# Altium schematic sheet ESPMODULE-E.B.EL-VENOM.SchDoc
size 381 x 241 mm
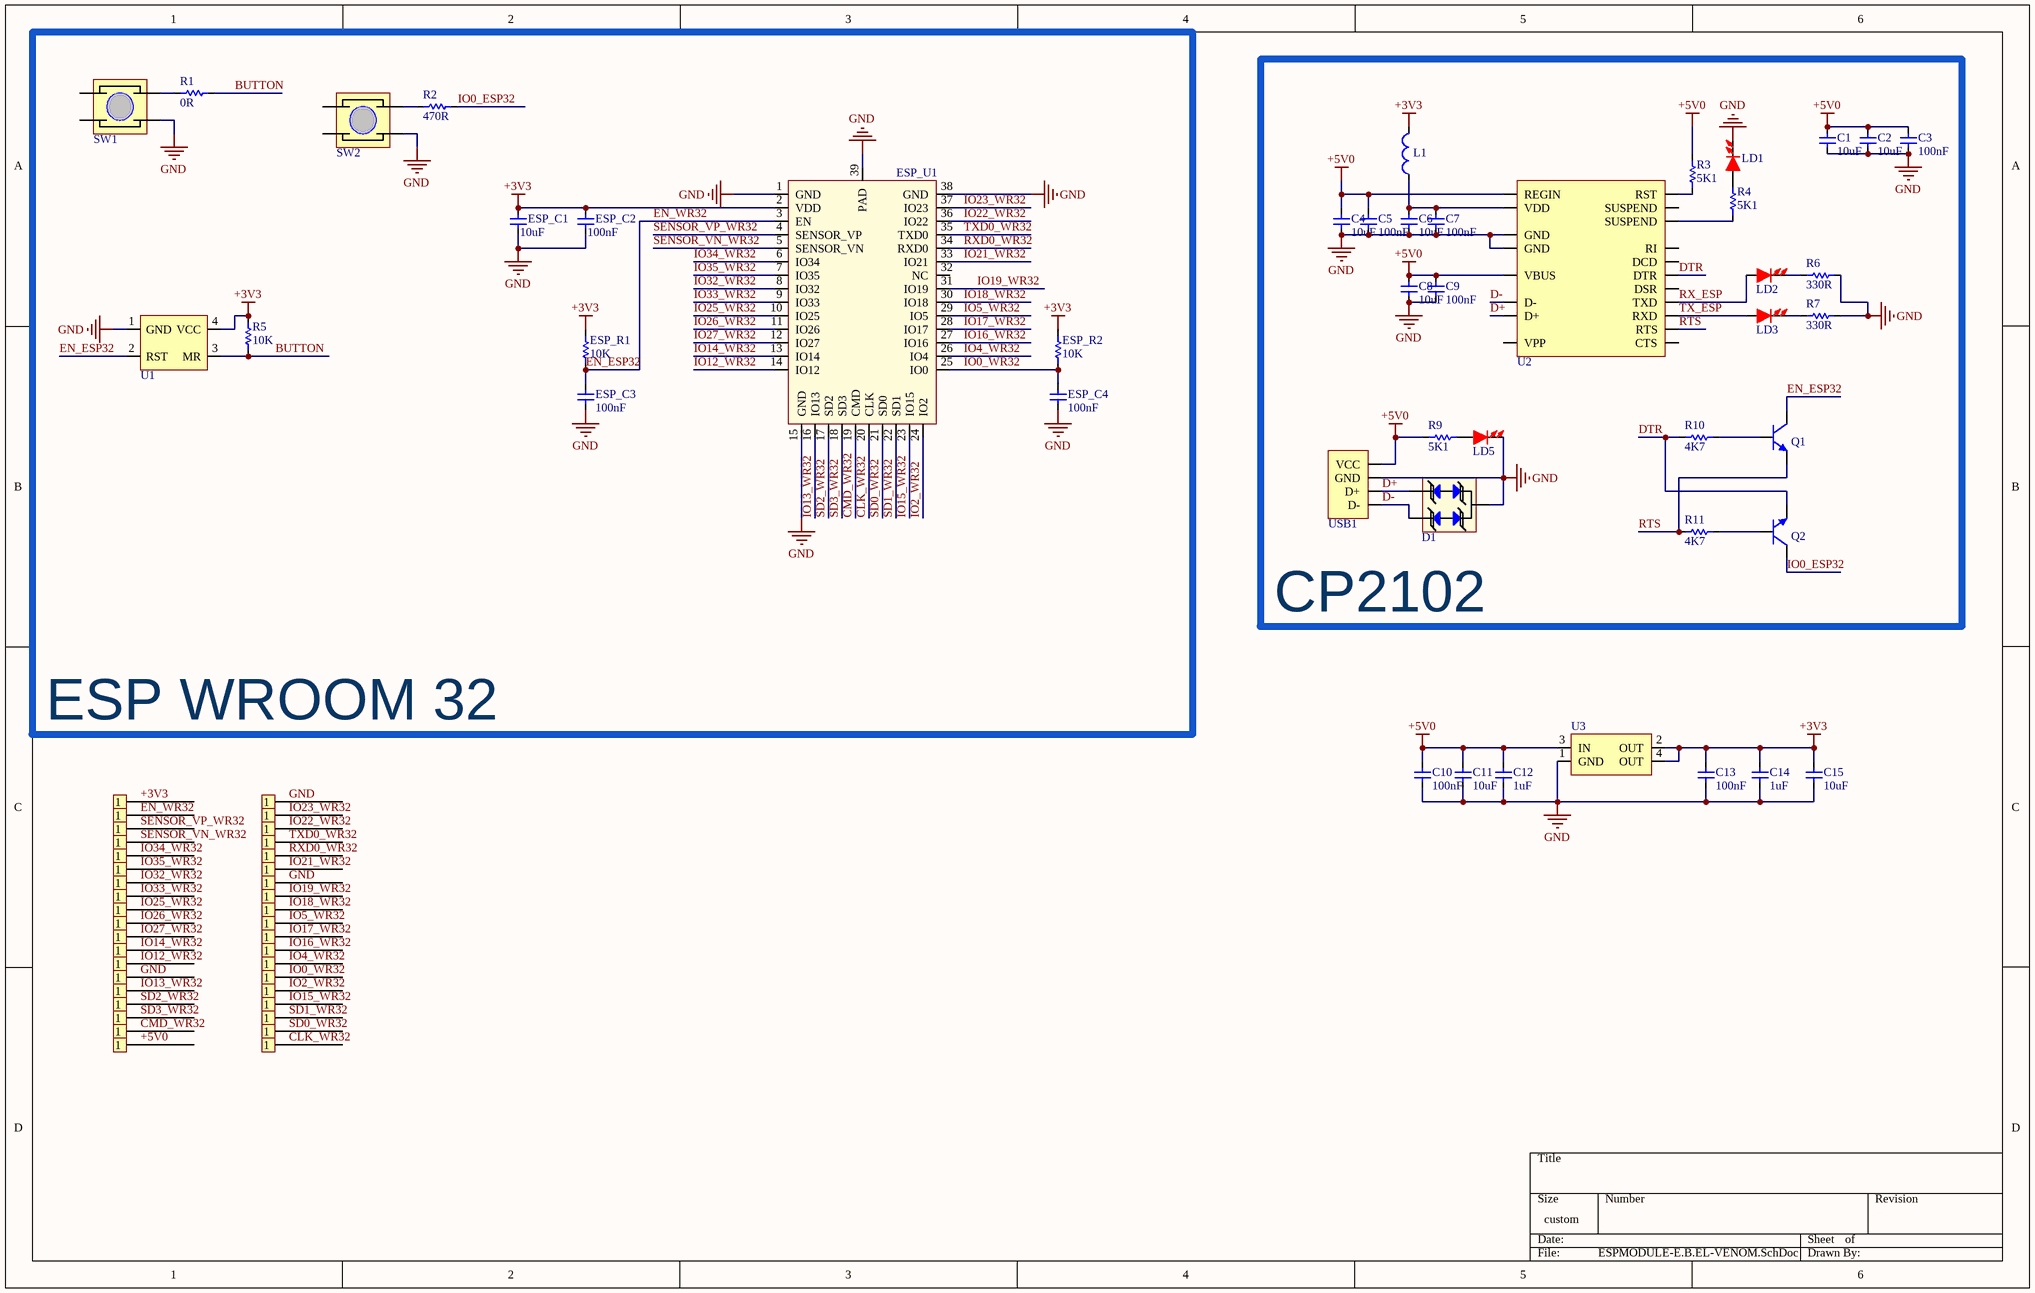
[diagram p0: ESPMODULE-E.B.EL-VENOM.SchDoc]

## Parts
C1  10uF  [0805C]
C2  10uF  [0805C]
C3  100nF  [0603C]
C4  10uF  [0805C]
C5  100nF  [0603C]
C6  10uF  [0805C]
C7  100nF  [0603C]
C8  10uF  [0805C]
C9  100nF  [0603C]
C10  100nF  [0603C]
C11  10uF  [0805C]
C12  1uF  [0603C]
C13  100nF  [0603C]
C14  1uF  [0603C]
C15  10uF  [0805C]
CON1  Connector 1p  [HEADER 1 DIP ERKEK 180]  (value not drawn)
CON2  Connector 1p  [HEADER 1 DIP ERKEK 180]  (value not drawn)
CON3  Connector 1p  [HEADER 1 DIP ERKEK 180]  (value not drawn)
CON4  Connector 1p  [HEADER 1 DIP ERKEK 180]  (value not drawn)
CON5  Connector 1p  [HEADER 1 DIP ERKEK 180]  (value not drawn)
CON6  Connector 1p  [HEADER 1 DIP ERKEK 180]  (value not drawn)
CON7  Connector 1p  [HEADER 1 DIP ERKEK 180]  (value not drawn)
CON8  Connector 1p  [HEADER 1 DIP ERKEK 180]  (value not drawn)
CON9  Connector 1p  [HEADER 1 DIP ERKEK 180]  (value not drawn)
CON10  Connector 1p  [HEADER 1 DIP ERKEK 180]  (value not drawn)
CON11  Connector 1p  [HEADER 1 DIP ERKEK 180]  (value not drawn)
CON12  Connector 1p  [HEADER 1 DIP ERKEK 180]  (value not drawn)
CON13  Connector 1p  [HEADER 1 DIP ERKEK 180]  (value not drawn)
CON14  Connector 1p  [HEADER 1 DIP ERKEK 180]  (value not drawn)
CON15  Connector 1p  [HEADER 1 DIP ERKEK 180]  (value not drawn)
CON16  Connector 1p  [HEADER 1 DIP ERKEK 180]  (value not drawn)
CON17  Connector 1p  [HEADER 1 DIP ERKEK 180]  (value not drawn)
CON18  Connector 1p  [HEADER 1 DIP ERKEK 180]  (value not drawn)
CON19  Connector 1p  [HEADER 1 DIP ERKEK 180]  (value not drawn)
CON20  Connector 1p  [HEADER 1 DIP ERKEK 180]  (value not drawn)
CON21  Connector 1p  [HEADER 1 DIP ERKEK 180]  (value not drawn)
CON22  Connector 1p  [HEADER 1 DIP ERKEK 180]  (value not drawn)
CON23  Connector 1p  [HEADER 1 DIP ERKEK 180]  (value not drawn)
CON24  Connector 1p  [HEADER 1 DIP ERKEK 180]  (value not drawn)
CON25  Connector 1p  [HEADER 1 DIP ERKEK 180]  (value not drawn)
CON26  Connector 1p  [HEADER 1 DIP ERKEK 180]  (value not drawn)
CON27  Connector 1p  [HEADER 1 DIP ERKEK 180]  (value not drawn)
CON28  Connector 1p  [HEADER 1 DIP ERKEK 180]  (value not drawn)
CON29  Connector 1p  [HEADER 1 DIP ERKEK 180]  (value not drawn)
CON30  Connector 1p  [HEADER 1 DIP ERKEK 180]  (value not drawn)
CON31  Connector 1p  [HEADER 1 DIP ERKEK 180]  (value not drawn)
CON32  Connector 1p  [HEADER 1 DIP ERKEK 180]  (value not drawn)
CON33  Connector 1p  [HEADER 1 DIP ERKEK 180]  (value not drawn)
CON34  Connector 1p  [HEADER 1 DIP ERKEK 180]  (value not drawn)
CON35  Connector 1p  [HEADER 1 DIP ERKEK 180]  (value not drawn)
CON36  Connector 1p  [HEADER 1 DIP ERKEK 180]  (value not drawn)
CON37  Connector 1p  [HEADER 1 DIP ERKEK 180]  (value not drawn)
CON38  Connector 1p  [HEADER 1 DIP ERKEK 180]  (value not drawn)
D1  TVS Diode 3p  [SOT23]  (value not drawn)
ESP_C1  10uF  [0805C]
ESP_C2  100nF  [0603C]
ESP_C3  100nF  [0603C]
ESP_C4  100nF  [0603C]
ESP_R1  10K  [0603R]
ESP_R2  10K  [0603R]
ESP_U1  ESP_WROOM_32  [ESP-WROOM-32]  (value not drawn)
L1  Ferrite  [0805L]  (value not drawn)
LD1  LED  [0805LED]  (value not drawn)
LD2  LED  [0805LED]  (value not drawn)
LD3  LED  [0805LED]  (value not drawn)
LD5  LED  [0805LED]  (value not drawn)
Q1  NPN  [SOT23]  (value not drawn)
Q2  NPN  [SOT23]  (value not drawn)
R1  0R  [0603R]
R2  470R  [0603R]
R3  5K1  [0603R]
R4  5K1  [0603R]
R5  10K  [0603R]
R6  330R  [0603R]
R7  330R  [0603R]
R9  5K1  [0603R]
R10  4K7  [0603R]
R11  4K7  [0603R]
SW1  Button  [BUTTON 6x6 4.3MM]  (value not drawn)
SW2  Button  [BUTTON 6x6 4.3MM]  (value not drawn)
U1  CAT811  [SOT-143]  (value not drawn)
U2  CP2102  [QFN-28 5x5x0.5]  (value not drawn)
U3  LM1117  [SOT223]  (value not drawn)
USB1  USB  [USB B MICRO 90]  (value not drawn)

## Blocks framed on the sheet
ESP WROOM 32: ESP_C1-ESP_C4 ESP_R1 ESP_R2 ESP_U1 R1 R2 R5 SW1 SW2 U1
CP2102: C1-C9 D1 L1 LD1-LD3 LD5 Q1 Q2 R3 R4 R6 R7 R9-R11 U2 USB1

## Nets
+3V3: C13.2 C14.2 C15.2 CON1.1 ESP_C1.2 ESP_C2.2 ESP_R1.2 ESP_R2.2 ESP_U1.2(VDD) L1.2 R5.2 U1.4(VCC) U3.2(OUT) U3.4(OUT)
+5V0: C1.2 C2.2 C3.2 C4.2 C5.2 C8.2 C9.2 C10.2 C11.2 C12.2 CON37.1 R3.2 R9.1 U2.7(REGIN) U2.8(VBUS) U3.3(IN) USB1.VCC
GND: C1.1 C2.1 C3.1 C4.1 C5.1 C6.1 C7.1 C8.1 C9.1 C10.1 C11.1 C12.1 C13.1 C14.1 C15.1 CON2.1 CON14.1 CON27.1 D1.3 ESP_C1.1 ESP_C2.1 ESP_C3.1 ESP_C4.1 ESP_U1.1(GND) ESP_U1.15(GND) ESP_U1.38(GND) ESP_U1.39(PAD) LD1.2(K) LD5.2(K) R6.2 R7.2 SW1.3 SW2.3 U1.1(GND) U2.3(GND) U2.29(GND) U3.1(GND) USB1.GND
BUTTON: R1.2 R5.1 U1.3(MR)
CLK_WR32: CON38.1 ESP_U1.20(CLK)
CMD_WR32: CON35.1 ESP_U1.19(CMD)
D+: D1.2 U2.4(D+) USB1.D+
D-: D1.1 U2.5(D-) USB1.D-
DTR: Q2.2(E) R10.1 U2.28(DTR)
EN_ESP32: CON3.1 ESP_C3.2 ESP_R1.1 ESP_U1.3(EN) Q1.3(C) U1.2(RST)  [also labelled EN_WR32]
IO0_ESP32: Q2.3(C) R2.2
IO0_WR32: CON28.1 ESP_C4.2 ESP_R2.1 ESP_U1.25(IO0)
IO2_WR32: CON30.1 ESP_U1.24(IO2)
IO4_WR32: CON26.1 ESP_U1.26(IO4)
IO5_WR32: CON20.1 ESP_U1.29(IO5)
IO12_WR32: CON25.1 ESP_U1.14(IO12)
IO13_WR32: CON29.1 ESP_U1.16(IO13)
IO14_WR32: CON23.1 ESP_U1.13(IO14)
IO15_WR32: CON32.1 ESP_U1.23(IO15)
IO16_WR32: CON24.1 ESP_U1.27(IO16)
IO17_WR32: CON22.1 ESP_U1.28(IO17)
IO18_WR32: CON18.1 ESP_U1.30(IO18)
IO19_WR32: CON16.1 ESP_U1.31(IO19)
IO21_WR32: CON12.1 ESP_U1.33(IO21)
IO22_WR32: CON6.1 ESP_U1.36(IO22)
IO23_WR32: CON4.1 ESP_U1.37(IO23)
IO25_WR32: CON17.1 ESP_U1.10(IO25)
IO26_WR32: CON19.1 ESP_U1.11(IO26)
IO27_WR32: CON21.1 ESP_U1.12(IO27)
IO32_WR32: CON13.1 ESP_U1.8(IO32)
IO33_WR32: CON15.1 ESP_U1.9(IO33)
IO34_WR32: CON9.1 ESP_U1.6(IO34)
IO35_WR32: CON11.1 ESP_U1.7(IO35)
RTS: Q1.2(E) R11.1 U2.24(RTS)
RX_ESP: LD2.1(A) U2.26(TXD)
RXD0_WR32: CON10.1 ESP_U1.34(RXD0)
SD0_WR32: CON36.1 ESP_U1.21(SD0)
SD1_WR32: CON34.1 ESP_U1.22(SD1)
SD2_WR32: CON31.1 ESP_U1.17(SD2)
SD3_WR32: CON33.1 ESP_U1.18(SD3)
SENSOR_VN_WR32: CON7.1 ESP_U1.5(SENSOR_VN)
SENSOR_VP_WR32: CON5.1 ESP_U1.4(SENSOR_VP)
TX_ESP: LD3.1(A) U2.25(RXD)
TXD0_WR32: CON8.1 ESP_U1.35(TXD0)
NetC6_2: C6.2 C7.2 L1.1 U2.6(VDD)
NetLD1_1: LD1.1(A) R4.1
NetLD2_2: LD2.2(K) R6.1
NetLD3_2: LD3.2(K) R7.1
NetLD5_1: LD5.1(A) R9.2
NetQ1_1: Q1.1(B) R10.2
NetQ2_1: Q2.1(B) R11.2
NetR1_1: R1.1 SW1.4
NetR2_1: R2.1 SW2.4
NetR3_1: R3.1 U2.9(RST)
NetR4_2: R4.2 U2.11(SUSPEND)

Not connected (* = marked no-connect by the designer): ESP_U1 32(NC); SW1 1 2; SW2 1 2; U2 1(DCD) 2(RI) 12(SUSPEND) 18(VPP) 23(CTS) 27(DSR)

## Library data of the parts
C1 C2 C4 C6 C8 C11 C15 = Cap 10uF 16V 0805: CAP 0805 10uF 16V X5R; Cari: H.PSF.CAP.016; Type: SMD; Component Name: Cap 10uF 16V 0805; Value: 10uF
  C1 C2 C4 C6 C8: Stock: 7053
  C11 C15: Stock: 61429
C3 C5 C7 C9 C10 C13 = Cap 100nF 50V 0603: CAP 0603 100nF 50V X7R; Cari: H.PSF.CAP.002; Type: SMD; Component Name: Cap 100nF 50V 0603; Value: 100nF
  C3 C5 C7 C9: Stock: 49959
  C10 C13: Stock: 2316
C12 C14 = Cap 1uF 16V 0603: CAP 0603 1uF 16V X5R; Cari: H.PSF.CAP.008; Type: SMD; Component Name: Cap 1uF 16V 0603; Value: 1uF; Stock: 4980
CON1-CON38 = Header 1 Dip Erkek 180: P.HEADER 1x40 PIN 180 DERECE DIP ERKEK; Cari: H.PSF.HDR.002; Component Name: Header 1 Dip Erkek 180; Type: DIP; Stock: 614
D1 = Diode TVS CDSOT23-SM712: CDSOT23-SM712 DIODE TVS 400W 26V; Cari: H.AKT.SEM.023; Type: SMD; Component Name: Diode TVS CDSOT23-SM712; Stock: 2634
ESP_C1 = Cap 10uF 16V 0805: CAP 0805 10uF 16V X5R; Cari: H.PSF.CAP.016; Component Name: Cap 10uF 16V 0805; Value: 10uF; Type: SMD; Stock: 7053
ESP_C2-ESP_C4 = Cap 100nF 50V 0603: CAP 0603 100nF 50V X7R; Cari: H.PSF.CAP.002; Component Name: Cap 100nF 50V 0603; Value: 100nF; Type: SMD; Stock: 49959
ESP_R1 ESP_R2 R5 = RES 0603 10K %1: RES 0603 10K 1% 1/10W-S; Cari: H.PSF.RES.015; Component Name: RES 0603 10K %1; Value: 10K; Type: SMD; Stock: 9276
ESP_U1 = ESP-WROOM-32: ESP-WROOM-32 WİFİ MODULÜ; Cari: H.AKT.ICS.072; Component Name: ESP-WROOM-32; Type: SMD; Stock: 191
L1 = Inductor Ferrite 2K5 0805: INDUCTOR 2K5 SMD 0805 FERRITE 250mA; Cari: H.PSF.IND.004; Component Name: Inductor Ferrite 2K5 0805; Value: 2K5; Type: SMD; Stock: 12000
LD1 LD2 = Led 0805 Green: LED GREEN SMD 0805; Cari: H.PSF.LED.007; Component Name: Led 0805 Green; Type: SMD; Stock: 9685
LD3 = Led 0805 BLUE: LED BLUE SMD 0805; Cari: H.PSF.LED.026; Component Name: Led 0805 Blue; Type: SMD; Stock: 13101
LD5 = Led 0805 RED: LED RED SMD 0805; Cari: H.PSF.LED.016; Component Name: Led 0805 Red; Type: SMD; Stock: 7399
Q1 Q2 = Transistor NPN BC817: TRANSISTOR NPN BC817 0.5A SOT23; Cari: H.AKT.SEM.003; Type: SMD; Component Name: Transistor NPN BC817; Stock: 1197
R1 = RES 0603 0R %5: RES 0603 0R 5% 1/10W-S; Cari: H.PSF.RES.011; Component Name: RES 0603 0R %5; Value: 0R; Type: SMD; Stock: 14050
R2 = RES 0603 470R %1: RES 0603 470R 1% 1/10W-S; Cari: H.PSF.RES.002; Component Name: RES 0603 470R %1; Value: 470R; Type: SMD; Stock: 2040
R3 R4 R9 = RES 0603 5K1 %5: RES 0603 5K1 5% 1/10W-S; Cari: H.PSF.RES.059; Component Name: RES 0603 5K1 %5; Value: 5K1; Type: SMD; Stock: 1132
R6 R7 = RES 0603 330R %5: RES 0603 330R 5% 1/10W-S; Cari: H.PSF.RES.003; Component Name: RES 0603 330R %5; Value: 330R; Type: SMD; Stock: 75195
R10 R11 = RES 0603 4K7 %1: RES 0603 4K7 5% 1/10W-S; Cari: H.PSF.RES.009; Component Name: RES 0603 4K7 %1; Value: 4K7; Type: SMD; Stock: 50775
SW1 SW2 = Button 6x6x4.3mm: BUTTON 6x6 4.3MM; Cari: H.PSF.BUT.005; Component Name: Button 6x6x4.3mm; Type: DIP; Stock: 15933
U2 = CP2102: CP2102-GMR USB TO UART BRIDGE 28VQFN; Cari: H.AKT.ICS.080; Component Name: CP2102; Type: SMD; Stock: 141
U3 = Reg LM1117: REG 1117 3V3 SOT223; Cari: H.AKT.ICS.013; Component Name: Reg LM1117; Type: SMD; Stock: 5310
USB1 = USB B Micro 90: MICRO USB CONNECTOR TYPE B 90; Cari: H.PSF.CON.063; Component Name: USB B Micro 90; Type: SMD; Stock: 1193